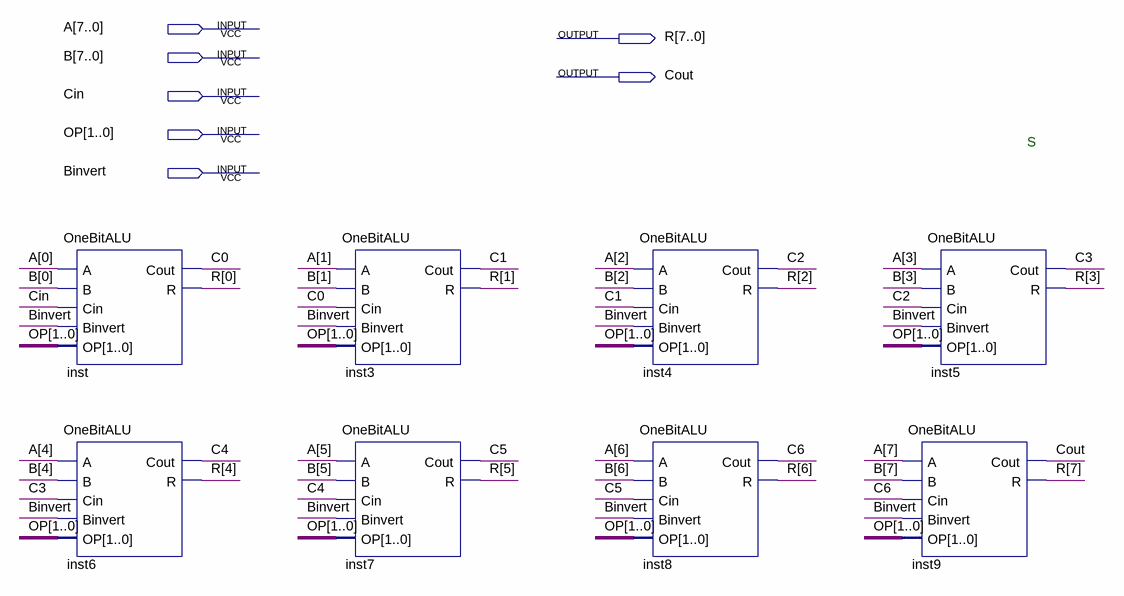
[diagram p0: schematic sheet]
// Quartus schematic EightBitALU.bdf as structural Verilog: 8 symbols, 7 pins
module EightBitALU (
  input  [7:0] A,
  input  [7:0] B,
  input  Cin,
  input  [1:0] OP,
  input  Binvert,
  output [7:0] R,
  output Cout
);

  wire C0, C1, C2, C3, C4, C5, C6;

  OneBitALU inst (.A(A[0]), .B(B[0]), .Cin(Cin), .Binvert(Binvert), .OP(OP), .Cout(C0), .R(R[0]));
  OneBitALU inst6 (.A(A[4]), .B(B[4]), .Cin(C3), .Binvert(Binvert), .OP(OP), .Cout(C4), .R(R[4]));
  OneBitALU inst3 (.A(A[1]), .B(B[1]), .Cin(C0), .Binvert(Binvert), .OP(OP), .Cout(C1), .R(R[1]));
  OneBitALU inst7 (.A(A[5]), .B(B[5]), .Cin(C4), .Binvert(Binvert), .OP(OP), .Cout(C5), .R(R[5]));
  OneBitALU inst4 (.A(A[2]), .B(B[2]), .Cin(C1), .Binvert(Binvert), .OP(OP), .Cout(C2), .R(R[2]));
  OneBitALU inst8 (.A(A[6]), .B(B[6]), .Cin(C5), .Binvert(Binvert), .OP(OP), .Cout(C6), .R(R[6]));
  OneBitALU inst5 (.A(A[3]), .B(B[3]), .Cin(C2), .Binvert(Binvert), .OP(OP), .Cout(C3), .R(R[3]));
  OneBitALU inst9 (.A(A[7]), .B(B[7]), .Cin(C6), .Binvert(Binvert), .OP(OP), .Cout(Cout), .R(R[7]));

  // Notes on the sheet:
  //   S
endmodule
